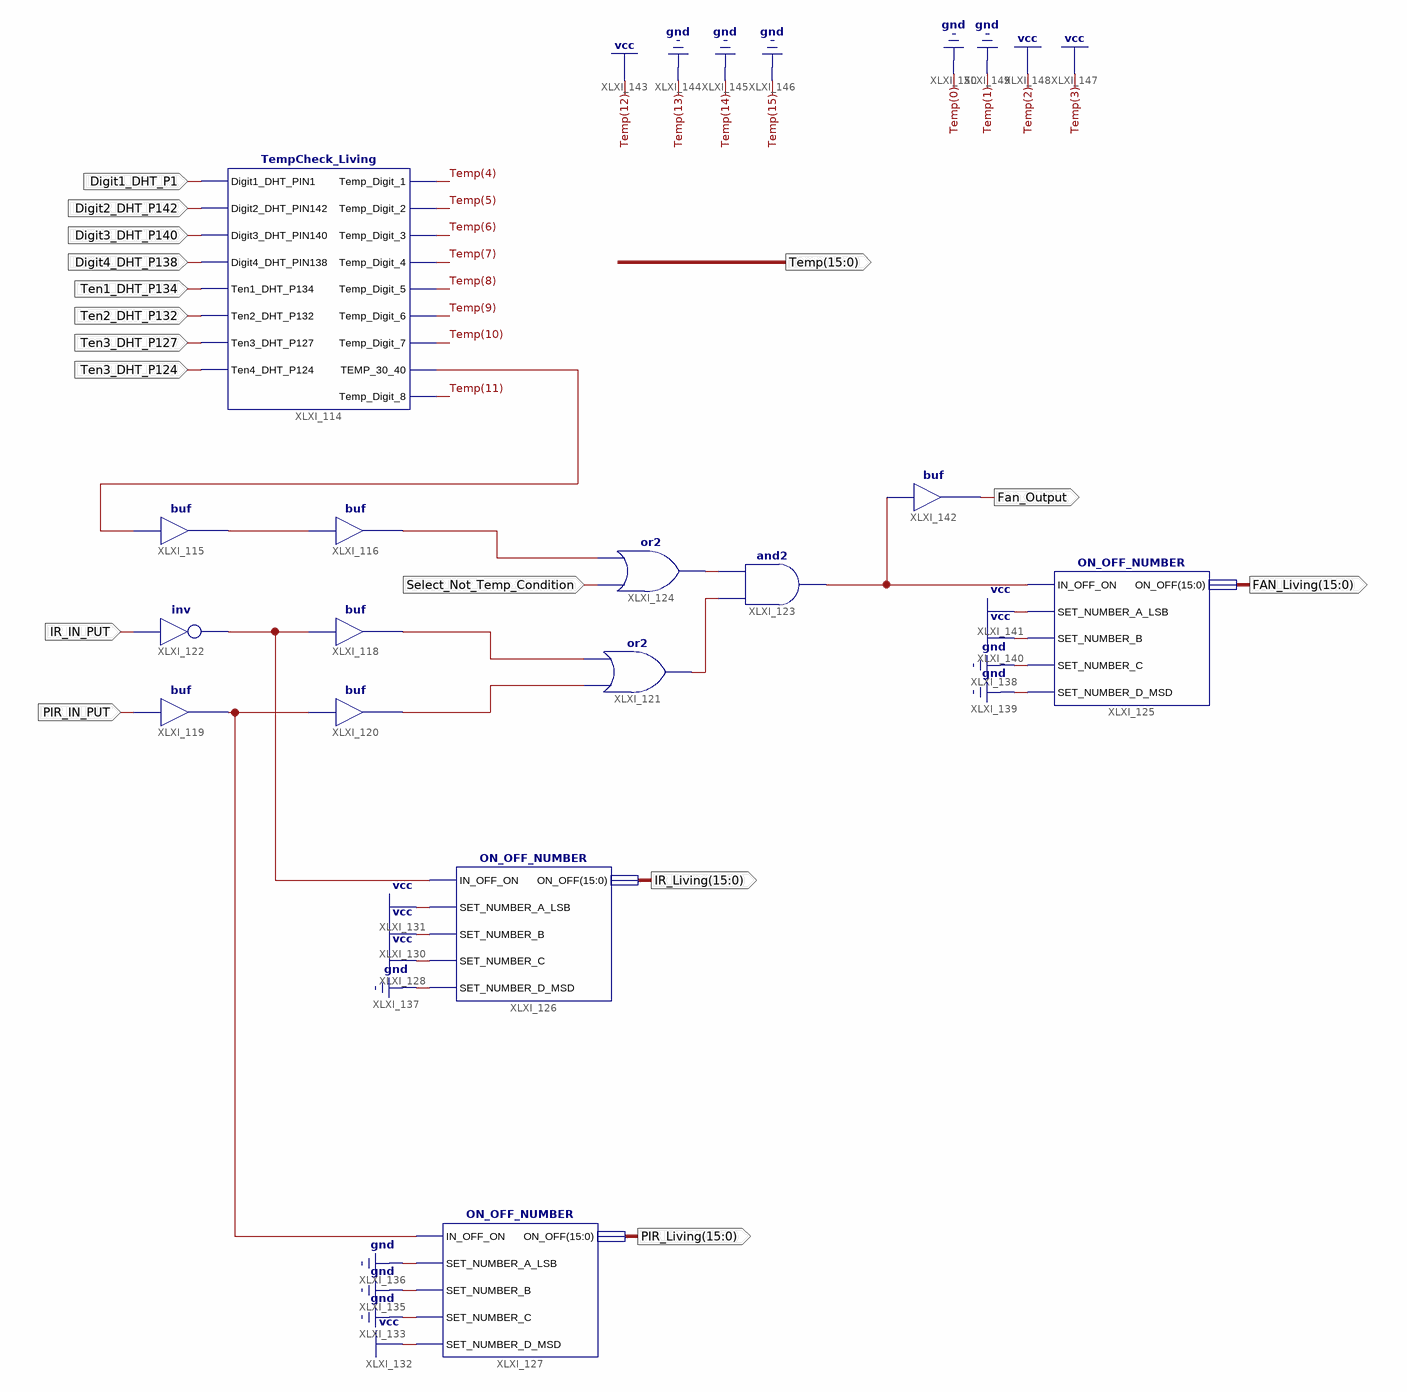
[diagram p0: schematic sheet 1]
// Xilinx ISE schematic LivingRoom.sch (spartan6) as structural Verilog: 14 symbols, 16 ports
module LivingRoom (
  input  Digit1_DHT_P1,
  input  Digit2_DHT_P142,
  input  Digit3_DHT_P140,
  input  Digit4_DHT_P138,
  input  Ten1_DHT_P134,
  input  Ten2_DHT_P132,
  input  Ten3_DHT_P127,
  input  Ten3_DHT_P124,
  input  IR_IN_PUT,
  input  PIR_IN_PUT,
  input  Select_Not_Temp_Condition,
  output [15:0] PIR_Living,
  output [15:0] IR_Living,
  output [15:0] FAN_Living,
  output Fan_Output,
  output [15:0] Temp
);

  wire XLXN_91, XLXN_92, XLXN_97, XLXN_98, XLXN_100, XLXN_101, XLXN_102, XLXN_104, XLXN_105, XLXN_106;

  TempCheck_Living XLXI_114 (
    .Digit1_DHT_PIN1(Digit1_DHT_P1), .Digit2_DHT_PIN142(Digit2_DHT_P142),
    .Digit3_DHT_PIN140(Digit3_DHT_P140), .Digit4_DHT_PIN138(Digit4_DHT_P138), .TEMP_30_40(XLXN_91),
    .Temp_Digit_1(Temp[4]), .Temp_Digit_2(Temp[5]), .Temp_Digit_3(Temp[6]), .Temp_Digit_4(Temp[7]),
    .Temp_Digit_5(Temp[8]), .Temp_Digit_6(Temp[9]), .Temp_Digit_7(Temp[10]), .Temp_Digit_8(Temp[11]),
    .Ten1_DHT_P134(Ten1_DHT_P134), .Ten2_DHT_P132(Ten2_DHT_P132), .Ten3_DHT_P127(Ten3_DHT_P127),
    .Ten4_DHT_P124(Ten3_DHT_P124));
  buf XLXI_115 (XLXN_92, XLXN_91);
  buf XLXI_116 (XLXN_102, XLXN_92);
  buf XLXI_118 (XLXN_97, XLXN_104);
  buf XLXI_119 (XLXN_105, PIR_IN_PUT);
  buf XLXI_120 (XLXN_98, XLXN_105);
  or XLXI_121 (XLXN_100, XLXN_98, XLXN_97);
  not XLXI_122 (XLXN_104, IR_IN_PUT);
  and XLXI_123 (XLXN_106, XLXN_100, XLXN_101);
  or XLXI_124 (XLXN_101, Select_Not_Temp_Condition, XLXN_102);
  ON_OFF_NUMBER XLXI_125 (
    .IN_OFF_ON(XLXN_106), .ON_OFF(FAN_Living), .SET_NUMBER_A_LSB(1'b1), .SET_NUMBER_B(1'b1),
    .SET_NUMBER_C(1'b0), .SET_NUMBER_D_MSD(1'b0));
  ON_OFF_NUMBER XLXI_126 (
    .IN_OFF_ON(XLXN_104), .ON_OFF(IR_Living), .SET_NUMBER_A_LSB(1'b1), .SET_NUMBER_B(1'b1),
    .SET_NUMBER_C(1'b1), .SET_NUMBER_D_MSD(1'b0));
  ON_OFF_NUMBER XLXI_127 (
    .IN_OFF_ON(XLXN_105), .ON_OFF(PIR_Living), .SET_NUMBER_A_LSB(1'b0), .SET_NUMBER_B(1'b0),
    .SET_NUMBER_C(1'b0), .SET_NUMBER_D_MSD(1'b1));
  buf XLXI_142 (Fan_Output, XLXN_106);

  assign {Temp[15:12], Temp[3:0]} = 8'b00011100;
endmodule
